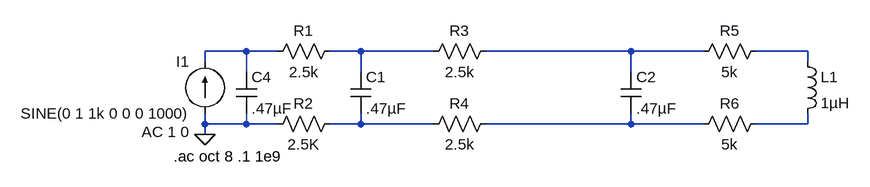
[diagram p0: schematic flux_bias.asc]
flux_bias.asc, the LTspice schematic file:
Version 4
SHEET 1 1096 680
WIRE 48 128 -16 128
WIRE 96 128 48 128
WIRE 224 128 176 128
WIRE 336 128 224 128
WIRE 640 128 416 128
WIRE 752 128 640 128
WIRE 912 128 832 128
WIRE -16 144 -16 128
WIRE 912 144 912 128
WIRE 48 160 48 128
WIRE 224 160 224 128
WIRE 640 160 640 128
WIRE -16 240 -16 224
WIRE 48 240 48 224
WIRE 48 240 -16 240
WIRE 96 240 48 240
WIRE 224 240 224 224
WIRE 224 240 176 240
WIRE 336 240 224 240
WIRE 640 240 640 224
WIRE 640 240 416 240
WIRE 752 240 640 240
WIRE 912 240 912 224
WIRE 912 240 832 240
WIRE -16 256 -16 240
FLAG -16 256 0
SYMBOL res 192 112 R90
WINDOW 0 0 56 VBottom 2
WINDOW 3 32 56 VTop 2
SYMATTR InstName R1
SYMATTR Value 2.5k
SYMBOL res 192 224 R90
WINDOW 0 0 56 VBottom 2
WINDOW 3 32 56 VTop 2
SYMATTR InstName R2
SYMATTR Value 2.5K
SYMBOL cap 208 160 R0
SYMATTR InstName C1
SYMATTR Value .47µF
SYMBOL current -16 224 R180
WINDOW 0 24 80 Left 2
WINDOW 3 24 0 Left 2
WINDOW 123 24 -28 Left 2
WINDOW 39 0 0 Left 2
SYMATTR InstName I1
SYMATTR Value SINE(0 1 1k 0 0 0 1000)
SYMATTR Value2 AC 1 0
SYMBOL res 432 112 R90
WINDOW 0 0 56 VBottom 2
WINDOW 3 32 56 VTop 2
SYMATTR InstName R3
SYMATTR Value 2.5k
SYMBOL res 432 224 R90
WINDOW 0 0 56 VBottom 2
WINDOW 3 32 56 VTop 2
SYMATTR InstName R4
SYMATTR Value 2.5k
SYMBOL cap 624 160 R0
SYMATTR InstName C2
SYMATTR Value .47µF
SYMBOL res 848 112 R90
WINDOW 0 0 56 VBottom 2
WINDOW 3 32 56 VTop 2
SYMATTR InstName R5
SYMATTR Value 5k
SYMBOL res 848 224 R90
WINDOW 0 0 56 VBottom 2
WINDOW 3 32 56 VTop 2
SYMATTR InstName R6
SYMATTR Value 5k
SYMBOL ind 896 128 R0
SYMATTR InstName L1
SYMATTR Value 1µH
SYMBOL cap 32 160 R0
SYMATTR InstName C4
SYMATTR Value .47µF
TEXT -64 290 Left 2 !.ac oct 8 .1 1e9

The netlist it stands for:
* flux_bias.asc
R1 N002 N001 2.5k
R2 N005 0 2.5K
C1 N002 N005 .47µF
I1 0 N001 SINE(0 1 1k 0 0 0 1000) AC 1 0
R3 N003 N002 2.5k
R4 N006 N005 2.5k
C2 N003 N006 .47µF
R5 N004 N003 5k
R6 N007 N006 5k
L1 N004 N007 1µH
C4 N001 0 .47µF
.ac oct 8 .1 1e9
.backanno
.end